# Altium project LiPo_Battery_Charger.PrjPcb
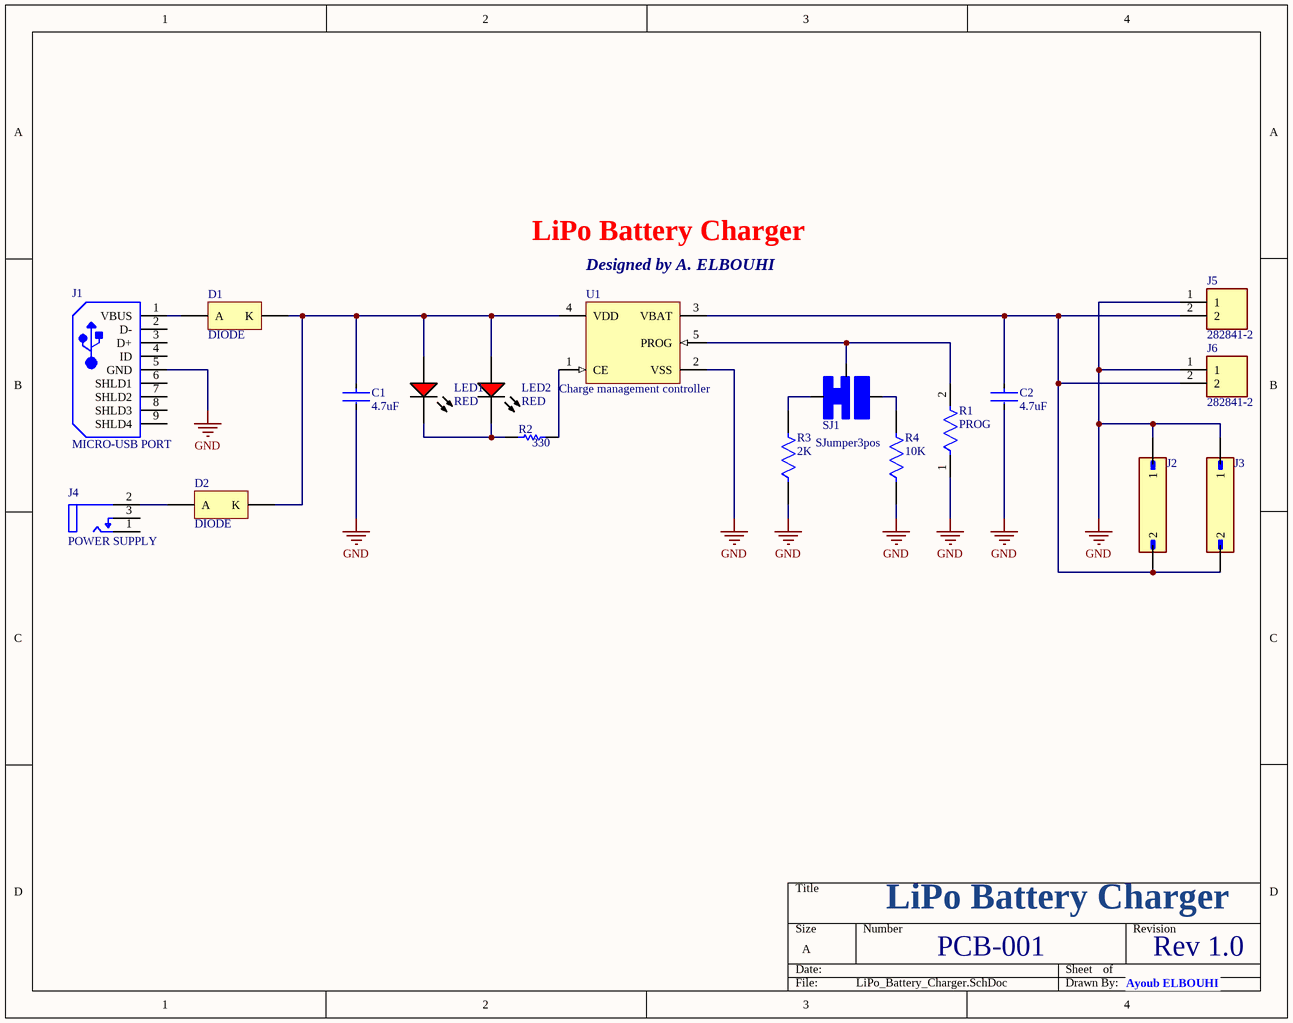
[diagram p0: LiPo_Battery_Charger.SchDoc]
1 sheet, 18 parts. Net scope: global (net labels, ports and power ports of the same name join across sheets).
Board file: LiPoBattery_charger_PCB.PcbDoc

## Sheet LiPo_Battery_Charger.SchDoc
size A; SheetNumber: 1; SheetTotal: 1

### Parts
C1  4.7uF  [FP-GRM155-0_15-IPC_C]
C2  4.7uF  [FP-GRM155-0_15-IPC_C]
D1  DIODE  [ONSC-SMA-2-403D-02_V]
D2  DIODE  [ONSC-SMA-2-403D-02_V]
J1  MICRO-USB PORT  [FCI-10104110-0001LF_V]
J2  67997-402HLF  [AMPHENOL_67997-402HLF]  (value not drawn)
J3  67997-402HLF  [AMPHENOL_67997-402HLF]  (value not drawn)
J4  POWER SUPPLY  [FP-RASM722PTR13X-MFG]
J5  282841-2  [TE_282841-2]
J6  282841-2  [TE_282841-2]
LED1  RED  [INDPR60-254-520X380X650]
LED2  RED  [INDPR60-254-520X380X650]
R1  PROG  [FP-CF18-MFG]
R2  330  [RESC3225X60X45ML20T20]
R3  2K  [FP-CR0603-IPC_B]
R4  10K  [FP-TFCR0805-IPC_B]
SJ1  SJumper3pos  [PCBComponent_1]
U1  Charge management controller  [SOT-23-OT5_M]

### Nets
GND: C1.2 C2.2 J1.5(GND) J2.1 J3.1 J5.1 J6.1 R1.1 R3.1 R4.1 U1.2(VSS)
NetC1_1: C1.1 D1.1(K) D2.1(K) LED1.1(A) LED2.1(A) U1.4(VDD)
NetC2_1: C2.1 J2.2 J3.2 J5.2 J6.2 U1.3(VBAT)
NetD1_2: D1.2(A) J1.1(VBUS)
NetD2_2: D2.2(A) J4.2(SLEEVE_TERMINAL)
NetLED1_2: LED1.2(K) LED2.2(K) R2.1
NetR1_2: R1.2 SJ1.2 U1.5(PROG)
NetR2_2: R2.2 U1.1(CE)
NetR3_2: R3.2 SJ1.1
NetR4_2: R4.2 SJ1.3

Not connected (* = marked no-connect by the designer): J1 2(D-) 3(D+) 4(ID) 6(SHLD1) 7(SHLD2) 8(SHLD3) 9(SHLD4); J4 1(TIP_TERMINAL(CENTER_PIN)) 3(SHUNT_TERMINAL)

### Notes on the sheet
- LiPo Battery Charger
- (near U1) Designed by A. ELBOUHI
- PCB-001
- Rev 1.0
- Ayoub ELBOUHI

### Library data of the parts
C1 C2 = CMP-06035-015349-1: Chip Multilayer Ceramic Capacitors for General Purpose, 0402, 4.7uF, X6S, 22%, 20%, 6.3V; Capacitance: 4.7uF; Tolerance: 20%; Length: 1mm; Voltage Rating (DC): 6.3V; Thickness: 500um; Width: 500um; Dielectric: X6S
D1 D2 = CMP-1055-00320-1: Schottky Power Rectifier, 2-Pin SMA, Pb-Free, Tape and Reel; PartNumber: MBRA140T3G; Manufacturer: On Semiconductor; Configuration: Single; IFSM Max (A): 30; PackageReference: SMA-2-403D-02; PackageDescription: 2-Pin Small Molded Package, J-Bend Lead, Body 2.605 x 4.315 mm; RoHS: TRUE; ComponentLink1Description: Manufacturer URL; Packing: Tape and Reel; ComponentLink3URL: http://www.onsemi.com/pub_link/Collateral/403D-02.PDF; ComponentLink2Description: Datasheet; ComponentLink2URL: http://www.onsemi.cn/pub_link/Collateral/MBRA140T3-D.PDF; DatasheetVersion: Rev. 10; ComponentLink1URL: http://www.onsemi.com/; ComponentLink3Description: Package Specification; Mounting Technology: Surface Mount; PackageVersion: Rev. G, 07/2012
J1 = CMP-2000-05823-1: Micro USB, Receptacle, -55 to 85 degC, 5-Pin SMD, RoHS, Tape and Reel; Manufacturer: FCI Electronics; Connector Type: USBMicroB; Contact Termination: SurfaceMountRightAngle; Connector Mounting: PCB; No. of Contacts: 5; Manufacturer URL: http://portal.fciconnect.com/; Contact Plating: Gold; Package Description: 5-Pin Surface Mount Device, Body 8.06 x 5.6 mm, Pitch 0.65 mm; Datasheet URL: http://portal.fciconnect.com/Comergent//fci/drawing/10104110.pdf; Datasheet Version: Rev. C, 03/2011; Package Reference: 10104110-0001LF; Mounting Technology: SurfaceMount; Gender: Receptacle
J2 J3 = 67997-402HLF: MF: {'manufacturer': u'Amphenol ICC (FCI)'}; Package: None; Price: None; Value: *; MP: 67997-402HLF; Availability: Unavailable
J4 = CMP-47995-000002-1: CONN PWR JACK 2.1X5.5MM SOLDER; Shielding: Unshielded; Gender: Male; Current Rating: 5A; Termination: Solder; Contact Material: Copper Alloy; Package Quantity: 120; Case/Package: SMD/SMT; Contact Plating: Tin; Connector Type: Jack; Housing Material: Thermoplastic; Mount: Surface Mount; Housing Color: Black; Color: Black
J5 J6 = 282841-2: Conn Terminal Block 2 POS 5.08mm Solder ST Thru-Hole 17.5A/Contact; MF: TE Connectivity; Purchase-URL: https://pricing.snapeda.com/search/part/282841-2/?ref=eda; SnapEDA_Link: https://www.snapeda.com/parts/282841-2/TE+Connectivity+AMP+Connectors/view-part/?ref=snap; MP: 282841-2; Package: None; Check_prices: https://www.snapeda.com/parts/282841-2/TE+Connectivity+AMP+Connectors/view-part/?ref=eda; EU_RoHS_Compliance: Compliant with Exemptions; Price: None; Availability: In Stock; Value: *
LED1 LED2 = CMP-1674-00005-1: Radial LED, 12.6 mcd, 20 mA, 2 V, -55 to 100 degC, 2-Pin THD, RoHS, Bulk; Shielding: Unshielded; Resistance: 0.045 Ohm; Current Rating: 3.6 A; Tolerance: 20%; PackageReference: LTL-1CHE; PackageDescription: 2-Pin Through Hole Device, Dia 3.8 mm, Pitch 2.54 mm; Case\Package: Radial; Length: 0.97 inch; Width: 0.62 inch; Height: 1.1 inch; Radiation Hardening: No; Lead Pitch: 11.44 mm; ComponentLink1URL: http://www.us.liteon.com/; ComponentLink1Description: Manufacturer URL; RoHSCompliant: true; Packaging: Tray; Mount: Through Hole; Min Operating Temperature: -40 degC; Max Operating Temperature: 130 degC; ComponentLink2URL: https://datasheet.ciiva.com/15117/getdatasheetpartid-187746-15117985.pdf; Package Quantity: 55; ComponentLink2Description: Datasheet; DatasheetVersion: Dec-03
R1 = CMP-26528-000002-1: RES 10K OHM 1/8W 5% CF AXIAL; Manufacturer Part Number: CF18JT10K0; Manufacturer: Stackpole Electronics; Power Rating: 0.125W; Temperature Coefficient: 0-500ppm/°C; Resistance: 10kΩ; Voltage Rating: 250V; Value: 10kΩ; Temperature: -55°C to +155°C; Height: 2mm; Lead Free: Yes; Automotive: No; Device Class L2: Resistors; Package: CF18; Series: CF; ComponentLink2Description: Datasheet; Ipc Land Pattern Name: RESAD656W65L360D200; Temperature Range High: +155°C; RoHS: TRUE; Device Class L3: Through-Hole Resistors; Temperature Range Low: -55°C; Device Class L1: Passive Components; Category: Res; Octopart: https://octopart.com/cf18jt10k0-stackpole+electronics-19205642; Composition: Carbon Film; Digikey Description: RES 10K OHM 1/8W 5% CF AXIAL; ComponentLink2URL: http://www.seielect.com/Catalog/SEI-CF_CFM.pdf; Tolerance: 5%
R2 = CMP-2005-00707-1: Part Number: CRCW1210330RJNTA; Manufacturer: Vishay Dale
R3 = CMP-07231-005094-1: Thick Film Chip Resistors 0603 2kΩ 0.1W 5% 200ppm/°C; Resistance: 2kR; Power Rating: 100mW; Voltage Rating: 50V; Mount: Surface Mount; Termination: SMD/SMT; Max Operating Temperature: 155°C; Depth: 0.8mm; Case Code (Imperial): 0603; Thickness: 457um; Military Standard: Not; Features: Moisture Resistant; Temperature Coefficient: 200ppm/°C; Length: 0.063inch; Case Code (Metric): 1608; Number of Terminations: 2; Packaging: Tape and Reel; Width: 0.031inch; Composition: Thick Film; Min Operating Temperature: -55°C; Height: 0.022inch; Package Quantity: 10000; Tolerance: 5%; Case/Package: 0603; Max Power Dissipation: 100mW
R4 = CMP-250906-173936-1: RES Thin Film,  10kΩ, 0.1%, 0.1W, 50ppm/°C, 0805
SJ1 = Solder_jumper_3pos: solder jumper 3 pins
U1 = CMP-0133-00141-1: Simple, Miniature Single-Cell, Fully Integrated Li-Ion/Li-Polymer Charge Management Controller, 4.2V, 5-Pin SOT-23, Industrial Temperature, Tape and Reel; PackageReference: SOT-23-OT5; PackageVersion: revBB, Aug-2009; PackageDescription: 5-Lead Plastic Small Outline Transistor (OT) [SOT-23]; Code_IPC: SOT23-5; DatasheetVersion: revB, Sep-2007